# EAGLE design GrblMega2560 (EAGLE 6.6.0)
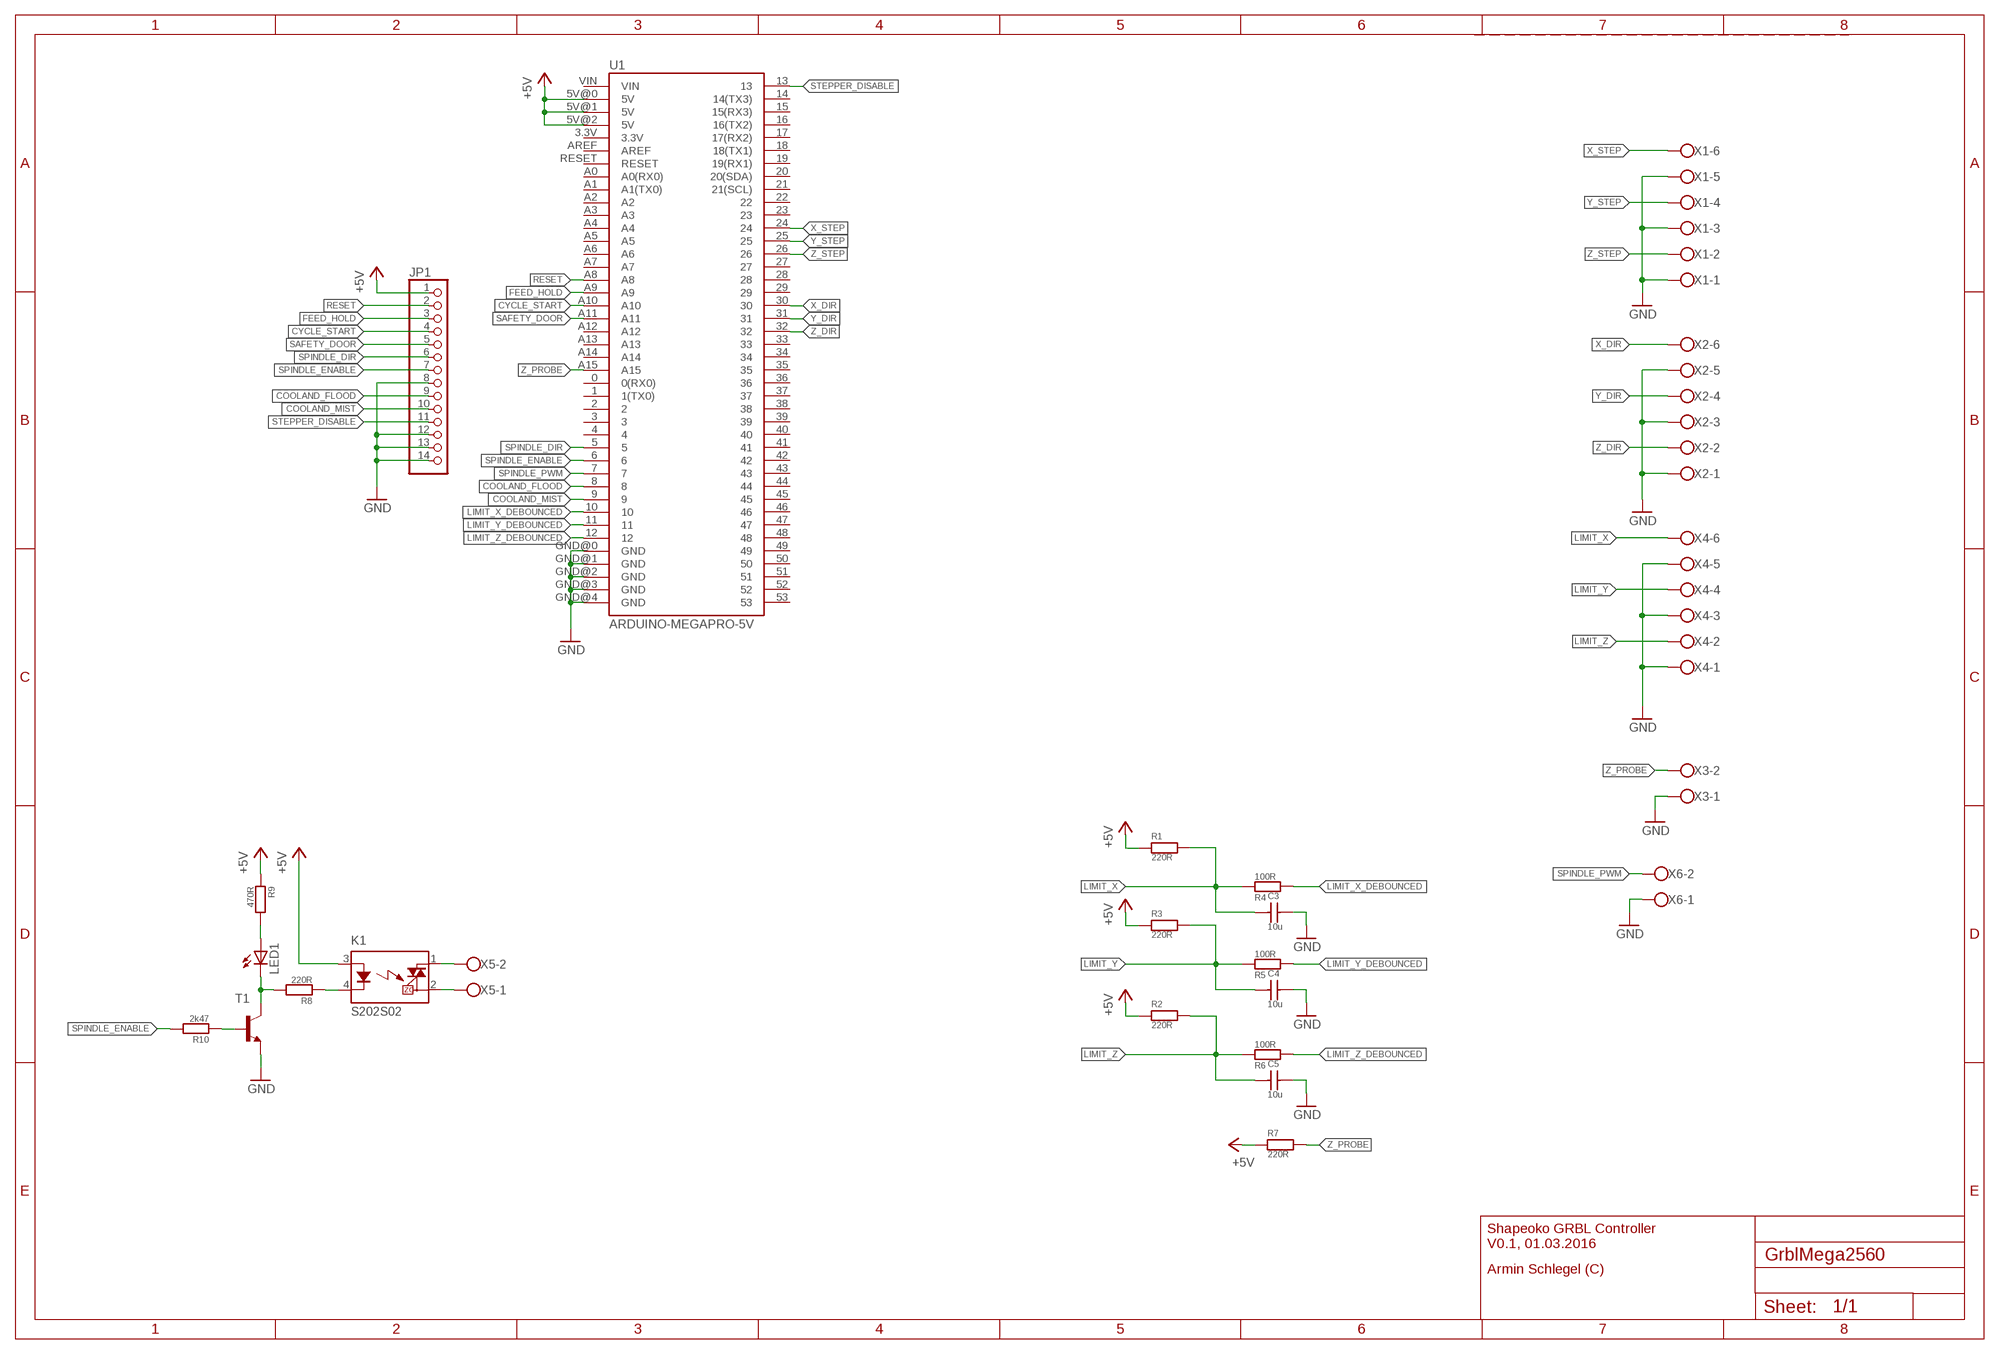
[diagram p0: schematic, sheet 1]

## Parts
C3  10u  C_SMD0805  [C0805]
C4  10u  C_SMD0805  [C0805]
C5  10u  C_SMD0805  [C0805]
JP1  PINHD-1X14  [1X14]
K1  S202S02  [S202S02]
LED1  LED3MM  [LED3MM]
R1  220R  R0603  [R0603]
R2  220R  R0603  [R0603]
R3  220R  R0603  [R0603]
R4  100R  R0603  [R0603]
R5  100R  R0603  [R0603]
R6  100R  R0603  [R0603]
R7  220R  R0603  [R0603]
R8  220R  R0603  [R0603]
R9  470R  R0603  [R0603]
R10  2k47  R0603  [R0603]
T1  BC847-NPN-SOT23-BEC  [SOT23-BEC]
U1  ARDUINO-MEGAPRO-5V  [ARDUINO_MEGA-PRO-5V]
X1  W237-136  [W237-136]
X2  W237-136  [W237-136]
X3  W237-102  [W237-102]
X4  W237-136  [W237-136]
X5  W237-102  [W237-102]
X6  W237-102  [W237-102]

## Nets
+5V: JP1.1 K1.3(A) R1.1 R2.1 R3.1 R7.1 R9.1 U1.5V@0(5V) U1.5V@1(5V) U1.5V@2(5V)
COOLAND_FLOOD: JP1.9 U1.8
COOLAND_MIST: JP1.10 U1.9
CYCLE_START: JP1.4 U1.A10
FEED_HOLD: JP1.3 U1.A9
GND: C3.2 C4.2 C5.2 JP1.8 JP1.12 JP1.13 JP1.14 T1.E U1.GND@0(GND) U1.GND@1(GND) U1.GND@2(GND) U1.GND@3(GND) U1.GND@4(GND) X1.1 X1.3 X1.5 X2.1 X2.3 X2.5 X3.1 X4.1 X4.3 X4.5 X6.1
LIMIT_X: C3.1 R1.2 R4.1 X4.6
LIMIT_X_DEBOUNCED: R4.2 U1.10
LIMIT_Y: C4.1 R3.2 R5.1 X4.4
LIMIT_Y_DEBOUNCED: R5.2 U1.11
LIMIT_Z: C5.1 R2.2 R6.1 X4.2
LIMIT_Z_DEBOUNCED: R6.2 U1.12
N$3: LED1.K(C) R8.2 T1.C
N$4: LED1.A R9.2
N$6: R10.1 T1.B
N$7: K1.4(K) R8.1
RESET: JP1.2 U1.A8
SAFETY_DOOR: JP1.5 U1.A11
SPINDLE_DIR: JP1.6 U1.5
SPINDLE_ENABLE: JP1.7 R10.2 U1.6
SPINDLE_N: K1.2(DS2) X5.1
SPINDLE_P: K1.1(DS1) X5.2
SPINDLE_PWM: U1.7 X6.2
STEPPER_DISABLE: JP1.11 U1.13
X_DIR: U1.30 X2.6
X_STEP: U1.24 X1.6
Y_DIR: U1.31 X2.4
Y_STEP: U1.25 X1.4
Z_DIR: U1.32 X2.2
Z_PROBE: R7.2 U1.A15 X3.2
Z_STEP: U1.26 X1.2
Unconnected: U1.0(0(RX0)) U1.1(1(TX0)) U1.2 U1.3 U1.3.3V U1.4 U1.14(14(TX3)) U1.15(15(RX3)) U1.16(16(TX2)) U1.17(17(RX2)) U1.18(18(TX1)) U1.19(19(RX1)) U1.20(20(SDA)) U1.21(21(SCL)) U1.22 U1.23 U1.27 U1.28 U1.29 U1.33 U1.34 U1.35 U1.36 U1.37 U1.38 U1.39 U1.40 U1.41 U1.42 U1.43 U1.44 U1.45 U1.46 U1.47 U1.48 U1.49 U1.50 U1.51 U1.52 U1.53 U1.A0(A0(RX0)) U1.A1(A1(TX0)) U1.A2 U1.A3 U1.A4 U1.A5 U1.A6 U1.A7 U1.A12 U1.A13 U1.A14 U1.AREF U1.RESET U1.VIN

## Notes on the sheet
- Shapeoko GRBL Controller
  V0.1, 01.03.2016
- Armin Schlegel (C)

## Library data of the parts
C3-C5 = SchlegelAr_Master:C_SMD: C SMD 0402, 0603, 0805, 1206 last modified: Armin Schlegel, 24.03.2014
JP1 = pinhead:PINHD-1X14: PIN HEADER
K1 = relay:S*02S02: IT(rms) 8A, Zero Cross type SIP 4pin Triac output SSR Source: http://sharp-world.com/products/device/lineup/data/pdf/datasheet/s102s02_e.pdf; MPN: S202S02F; OC_FARNELL: 1618475; OC_NEWARK: 14N9588
LED1 = led:LED: LED OSRAM: - CHIPLED LG R971, LG N971, LY N971, LG Q971, LY Q971, LO R971, LY R971 LH N974, LH R974 LS Q976, LO Q976, LY Q976 LO Q996 - Hyper CHIPLED LW Q18S LB Q993, LB Q99A, LB R99A - SideLED LS A670, LO A670, LY A670, LG A670, LP A670 LB A673, LV A673, LT A673, LW A673 LH A674 LY A675 LS A676, LA A676, LO A676, LY A676, LW A676 LS A679, LY A679, LG A679 - Hyper Micro SIDELED® LS Y876, LA Y876, LO Y876, LY Y876 LT Y87S - SmartLED LW L88C, LW L88S LB L89C, LB L89S, LG L890 LS L89K, LO L89K, LY L89K LS L896, LA L896, LO L896, LY L896 - TOPLED LS T670, LO T670, LY T670, LG T670, LP T670 LSG T670, LSP T670, LSY T670, LOP T670, LYG T670 LG T671, LOG T671, LSG T671 LB T673, LV T673, LT T673, LW T673 LH T674 LS T676, LA T676, LO T676, LY T676, LB T676, LH T676, LSB T676, LW T676 LB T67C, LV T67C, LT T67C, LS T67K, LO T67K, LY T67K, LW E67C LS E67B, LA E67B, LO E67B, LY E67B, LB E67C, LV E67C, LT E67C LW T67C LS T679, LY T679, LG T679 LS T770, LO T770, LY T770, LG T770, LP T770 LB T773, LV T773, LT T773, LW T773 LH T774 LS E675, LA E675, LY E675, LS T675 LS T776, LA T776, LO T776, LY T776, LB T776 LHGB T686 LT T68C, LB T68C - Hyper Mini TOPLED® LB M676 - Mini TOPLED Santana® LG M470 LS M47K, LO M47K, LY M47K Source: http://www.osram.convergy.de LUXEON: - LUMILED® LXK2-PW12-R00, LXK2-PW12-S00, LXK2-PW14-U00, LXK2-PW14-V00 LXK2-PM12-R00, LXK2-PM12-S00, LXK2-PM14-U00 LXK2-PE12-Q00, LXK2-PE12-R00, LXK2-PE12-S00, LXK2-PE14-T00, LXK2-PE14-U00 LXK2-PB12-K00, LXK2-PB12-L00, LXK2-PB12-M00, LXK2-PB14-N00, LXK2-PB14-P00, LXK2-PB14-Q00 LXK2-PR12-L00, LXK2-PR12-M00, LXK2-PR14-Q00, LXK2-PR14-R00 LXK2-PD12-Q00, LXK2-PD12-R00, LXK2-PD12-S00 LXK2-PH12-R00, LXK2-PH12-S00 LXK2-PL12-P00, LXK2-PL12-Q00, LXK2-PL12-R00 Source: www.luxeon.com KINGBRIGHT: KA-3528ASYC Source: www.kingbright.com
R1-R10 = SchlegelAr_Master:R: Widerstaende in 0402, 0603, 0805, 1206, 2512 last modified: Armin Schlegel, 28.04.2014
T1 = transistor:*-NPN-: NPN Transistror BF959 corrected 2008.03.06
U1 = SparkFun-Boards:ARDUINO-MEGA: Arduino Mega board footprint
X1 X2 X4 = con-wago-500:W237-136: WAGO SCREW CLAMP; MPN: 237-136; OC_FARNELL: unknown; OC_NEWARK: 84K9151
X3 X5 X6 = con-wago-500:W237-102: WAGO SCREW CLAMP; MPN: 237-102; OC_FARNELL: unknown; OC_NEWARK: 70K9898

## Board
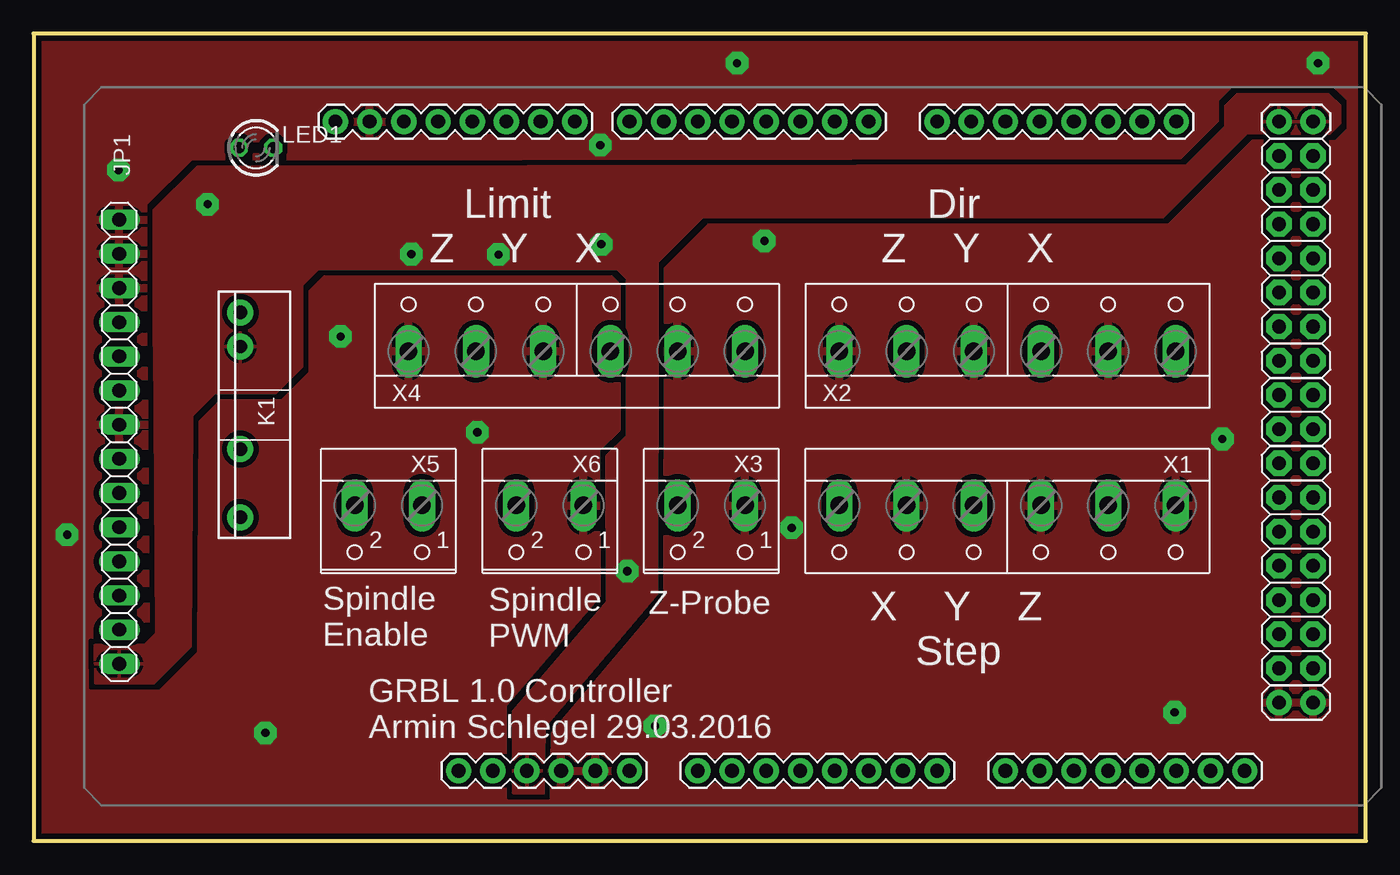
[diagram p1: board, top side]
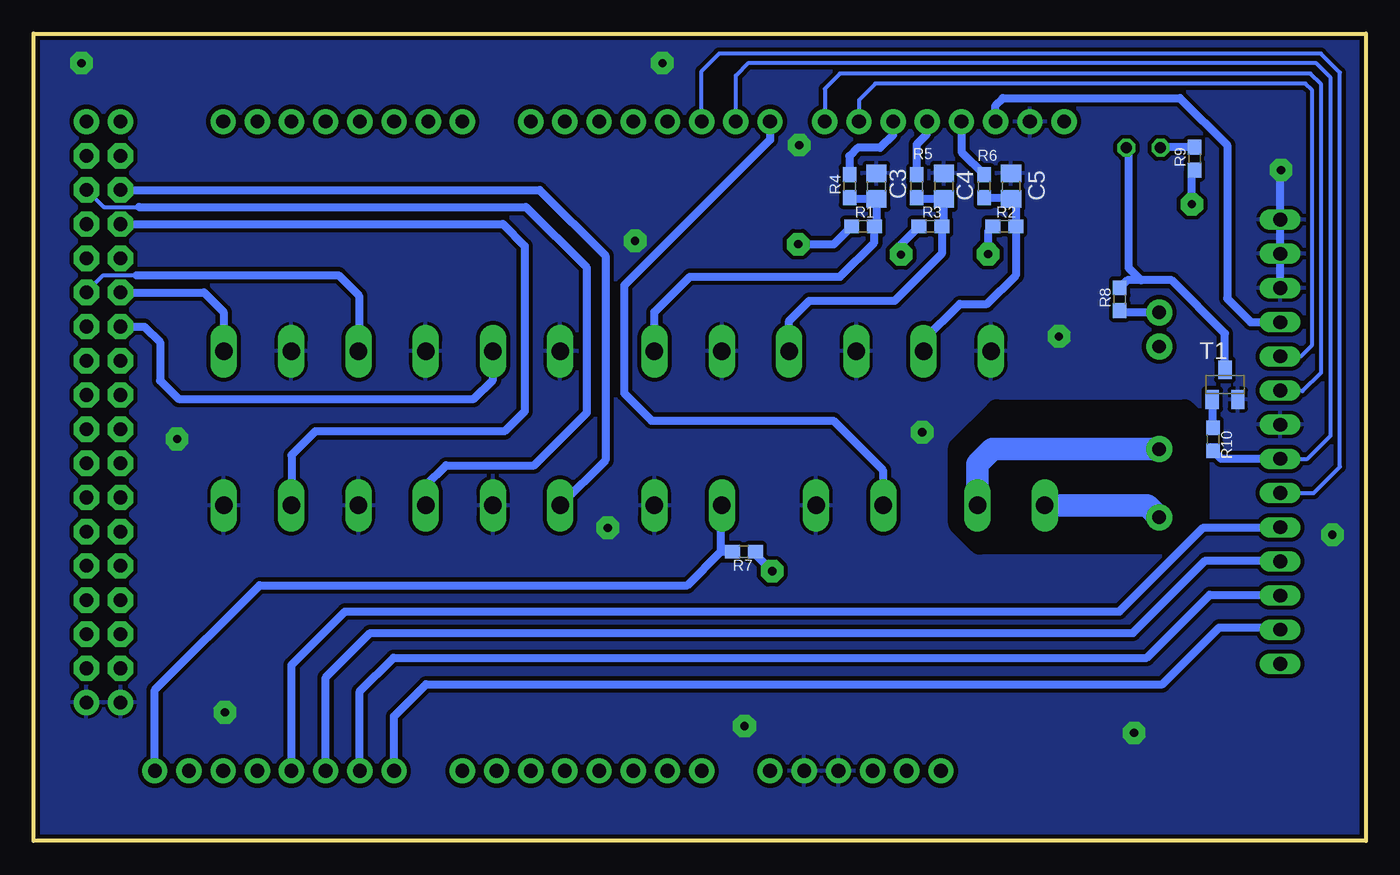
[diagram p2: board, bottom side, seen from below]

Size 99 x 60 mm. Coordinates in mm from the lower left corner, seen from the top.
Outline: 0,0 99,0 99,60 0,60 0,0
Copper layers (1*16): Top 0.035mm / dielectric 1.5mm / Bottom 0.035mm
Design rules "Elecrow_2-layer_eagle_rule": minimum track width 6mil, minimum drill 12mil, track to track 6mil, track to pad 6mil, pad to pad 6mil, via to via 6mil, smd to smd 0mil, copper to edge 10mil, drill to drill 10mil, minimum pad ring 10mil, minimum via ring 6mil, stop-mask expansion 2mil, vias tented up to drill 100mil, thermal gap 10mil
bRestrict: area 12.4,22.1 to 30.2,32

### Footprints (pad centres in the part's own frame; a part is rotated, then mirrored left to right if it is on the bottom)
C0805 = smd 1.3 x 1.5: 1 -0.95,0; 2 0.95,0
1X14 = drill 1.016 long: 1 -16.51,0; 2 -13.97,0; 3 -11.43,0; 4 -8.89,0; 5 -6.35,0; 6 -3.81,0; 7 -1.27,0; 8 1.27,0; 9 3.81,0; 10 6.35,0; 11 8.89,0; 12 11.43,0; 13 13.97,0; 14 16.51,0
S202S02 = drill 1 pad 1.93: 1 -7.62,0; 2 -2.54,0; 3 5.08,0; 4 7.62,0
LED3MM = drill 0.813 octagon: A -1.27,0; K 1.27,0
R0603 = smd 1.1 x 1: 1 -0.85,0; 2 0.85,0
SOT23-BEC = smd 1 x 1.4: B -0.95,-1.1; C 0,1.1; E 0.95,-1.1
ARDUINO_MEGA-PRO-5V = drill 1.016 pad 1.88: 0 60.85,50.8; 1 58.31,50.8; 2 55.77,50.8; 3 53.23,50.8; 3.3V 32.91,2.54; 4 50.69,50.8; 5 48.15,50.8; 5V@0 35.45,2.54; 5V@1 91.33,50.8; 5V@2 93.87,50.8; 6 45.61,50.8; 7 43.07,50.8; 8 39.006,50.8; 9 36.466,50.8; 10 33.926,50.8; 11 31.386,50.8; 12 28.846,50.8; 13 26.306,50.8; 14 65.93,50.8; 15 68.47,50.8; 16 71.01,50.8; 17 73.55,50.8; 18 76.09,50.8; 19 78.63,50.8; 20 81.17,50.8; 21 83.71,50.8; A0 48.15,2.54; A1 50.69,2.54; A2 53.23,2.54; A3 55.77,2.54; A4 58.31,2.54; A5 60.85,2.54; A6 63.39,2.54; A7 65.93,2.54; A8 71.01,2.54; A9 73.55,2.54; A10 76.09,2.54; A11 78.63,2.54; A12 81.17,2.54; A13 83.71,2.54; A14 86.25,2.54; A15 88.79,2.54; AREF 21.226,50.8; GND@0 37.99,2.54; GND@1 40.53,2.54; GND@2 91.33,7.62; GND@3 93.87,7.62; GND@4 23.766,50.8; RESET 30.37,2.54; VIN 43.07,2.54 | drill 1.016 pad 1.88 octagon: 22 91.33,48.26; 23 93.87,48.26; 24 91.33,45.72; 25 93.87,45.72; 26 91.33,43.18; 27 93.87,43.18; 28 91.33,40.64; 29 93.87,40.64; 30 91.33,38.1; 31 93.87,38.1; 32 91.33,35.56; 33 93.87,35.56; 34 91.33,33.02; 35 93.87,33.02; 36 91.33,30.48; 37 93.87,30.48; 38 91.33,27.94; 39 93.87,27.94; 40 91.33,25.4; 41 93.87,25.4; 42 91.33,22.86; 43 93.87,22.86; 44 91.33,20.32; 45 93.87,20.32; 46 91.33,17.78; 47 93.87,17.78; 48 91.33,15.24; 49 93.87,15.24; 50 91.33,12.7; 51 93.87,12.7; 52 91.33,10.16; 53 93.87,10.16
W237-136 = drill 1.3 long: 1 -12.5,-1.27; 2 -7.5,-1.27; 3 -2.5,-1.27; 4 2.5,-1.27; 5 7.5,-1.27; 6 12.5,-1.27
W237-102 = drill 1.3 long: 1 -2.5,-1.27; 2 2.5,-1.27

### Placement (x,y rotation side)
C3  36.36,48.66 90 bottom
C4  31.36,48.66 90 bottom
C5  26.36,48.66 90 bottom
JP1  6.36,29.66 90 top
K1  15.36,31.66 90 top
LED1  16.53,51.51 0 top
R1  37.36,45.66 0 bottom
R2  26.86,45.66 0 bottom
R3  32.36,45.66 0 bottom
R4  38.36,48.66 90 bottom
R5  33.36,48.66 90 bottom
R6  28.36,48.66 90 bottom
R7  46.22,21.49 180 bottom
R8  18.29,40.26 90 bottom
R9  12.73,50.71 90 bottom
R10  11.36,29.85 270 bottom
T1  10.46,33.91 0 bottom
U1  1.21,2.66 0 top
X1  72.36,23.66 180 top
X2  72.36,37.66 0 top
X3  50.36,23.66 180 top
X4  40.36,37.66 0 top
X5  26.36,23.66 180 top
X6  38.36,23.66 180 top

### Tracks (layer width: path | path; a pad name or v marks a point on that pad's centre or on a via)
+5V  (via drill 0.61 pad 1.68)
  Bottom 0.61: v12.93,47.32 12.93,49.67 R9.1 | v28.07,43.61 28.07,45.31 R2.1 | v34.54,43.59 34.54,44.33 R3.1 | v42.19,44.35 39.53,44.35 R1.1 | R7.1 45.37,21.29 v44.12,20.04
  pour Top (isolate 0.406): 96.27,52.58 90.17,52.65 83.9,46.38 49.71,46.38 46.33,43 46.33,39.17 46.3,18.34 37.95,8.46 37.85,3.53 35.66,3.58 35.66,9.63 42.65,17.75 42.62,28.6 44.12,30.1 44.12,41.78 43.38,42.52 21.13,42.52 19.91,41.3 19.91,35.26 17.98,33.32 13.46,33.32 11.76,31.62 11.63,14.45 8.92,11.73 4.6,11.73 4.57,14.53 8.26,14.53 9.14,15.42 8.99,36.83 8.97,36.83 8.97,46.86 12.19,50.09 85.7,50.19 88.6,53.09 88.6,54.61 89.46,55.47 96.22,55.47 97.05,54.64 97.05,53.34 96.85,53.14
COOLAND_FLOOD
  Bottom 0.305: JP1.9 6.31,33.42 4.71,33.42 3.33,34.8 3.33,56.24 4.12,57.02 39.09,57.02 40.21,55.91 U1.8
COOLAND_MIST
  Bottom 0.305: JP1.10 4.83,36.01 3.99,36.85 3.99,55.78 4.5,56.29 36.45,56.29 37.67,55.07 U1.9
CYCLE_START
  Bottom 0.61: U1.A10 77.3,12.14 73.99,15.44 17.3,15.44 11.91,20.83 6.42,20.83 JP1.4
FEED_HOLD
  Bottom 0.61: U1.A9 74.76,11.12 72.26,13.61 16.28,13.61 11.61,18.29 6.42,18.29 JP1.3
GND  (via drill 0.61 pad 1.68)
  Bottom 0.61: JP1.12 6.36,49.8 v6.3,49.86
  other vias: 2.49,22.76 32.97,30.38 56.34,23.27 88.34,29.87 54.31,44.6 52.27,57.81 42.11,51.71 84.79,9.55 46.18,8.53 17.22,8.03 22.81,37.49 95.45,57.81
  pour Bottom (isolate 0.305, rank 3): 0.03,59.97 99.01,59.97 99.01,0 0.03,0
  pour Top (isolate 0.406, rank 6): 0.03,59.97 98.98,59.97 98.98,-0.03 0.03,-0.03
LIMIT_X
  Bottom 0.61: R4.1 38.26,47.71 C3.1 36.36,45.81 R1.2 36.52,45.65 36.52,44.48 39.06,41.94 50.24,41.94 52.86,39.31 X4.6
LIMIT_X_DEBOUNCED
  Bottom 0.61: U1.10 35.13,52.47 36.09,51.51 37.77,51.51 38.38,50.9 38.38,49.53 R4.2
LIMIT_Y
  Bottom 0.305: 31.36,45.81 R3.2
  Bottom 0.61: 31.36,45.81 C4.1 33.26,47.71 R5.1 | X4.4 42.86,38.65 41.35,40.16 35,40.16 31.51,43.65 R3.2
LIMIT_Y_DEBOUNCED
  Bottom 0.61: R5.2 33.36,51.78 32.64,52.5 32.64,53.42 U1.11
LIMIT_Z
  Bottom 0.305: 26.01,47.36 C5.1
  Bottom 0.61: R6.1 26.46,47.81 C5.1 | 26.01,47.36 R2.2 26.01,42.03 28.14,39.9 30.18,39.9 32.86,37.22 X4.2
LIMIT_Z_DEBOUNCED
  Bottom 0.61: U1.12 30.05,51.2 R6.2
N$3
  Bottom 0.61: T1.C 10.46,37.72 14.43,41.68 16.71,41.68 | 16.71,41.68 17.72,41.68 R8.2 | 16.71,41.68 17.62,42.59 17.62,51.34 LED1.K
N$4
  Bottom 0.61: R9.2 15.21,51.56 LED1.A
N$6
  Bottom 0.61: T1.B 11.41,30.76 R10.1
N$7
  Bottom 0.61: K1.4 18.17,39.28 R8.1
RESET
  Bottom 0.61: U1.A8 72.22,9.27 69.85,11.63 15.11,11.63 10.9,15.85 6.52,15.85 JP1.2
SAFETY_DOOR
  Bottom 0.61: U1.A11 79.84,13.08 75.87,17.04 18.31,17.04 12.06,23.29 6.38,23.29 JP1.5
SPINDLE_DIR
  Bottom 0.305: JP1.6 3.88,25.85 1.93,27.81 1.93,57.1 3.35,58.52 48.06,58.52 49.36,57.22 U1.5
SPINDLE_ENABLE
  Bottom 0.305: JP1.7 4.34,28.39 2.62,30.12 2.62,56.72 3.68,57.78 45.92,57.78 46.82,56.89 U1.6
  Bottom 0.61: JP1.7 10.75,28.39 R10.2
SPINDLE_N
  Bottom 1.676: K1.2 27.75,29.12 28.86,28.01 X5.1
SPINDLE_P
  Bottom 1.676: X5.2 16.25,24.93 K1.1
SPINDLE_PWM
  Bottom 0.61: U1.7 44.28,52.12 55.12,41.27 55.12,33.27 53.09,31.24 39.57,31.24 38.91,30.58 35.89,27.56 35.89,24.96 X6.2
STEPPER_DISABLE
  Bottom 0.61: U1.13 27.51,54.68 26.98,55.22 13.82,55.22 10.31,51.71 10.31,40.31 8.56,38.56 JP1.11
X_DIR
  Bottom 0.61: U1.30 86.33,40.76 84.89,39.32 84.89,36.42 X2.6
X_STEP
  Bottom 0.61: U1.24 61.39,48.38 56.52,43.51 56.52,28.28 X1.6
Y_DIR
  Bottom 0.305: U1.31 95.08,40.77 93.81,42.04 91.11,42.04 91.36,42.04
  Bottom 0.61: 91.36,42.04 76.35,42.04 74.83,40.51 74.83,36.43 X2.4
Y_STEP
  Bottom 0.305: U1.25 95.04,48.38 93.78,47.12 91.19,47.12
  Bottom 0.61: X1.4 69.86,26.4 68.35,27.91 61.8,27.91 57.89,31.83 57.89,42.6 62.41,47.12 91.19,47.12
Z_DIR
  Bottom 0.61: U1.32 90.78,38.22 89.61,37.06 89.61,34.21 88.24,32.84 66.29,32.84 64.87,34.27 64.87,36.38 X2.2
Z_PROBE
  Bottom 0.61: U1.A15 90,11.22 82.22,19 50.42,19 47.9,21.51 | 47.9,21.51 47.9,24.89 X3.2 | R7.2 47.88,21.49 47.9,21.51
Z_STEP
  Bottom 0.61: U1.26 64.13,45.84 62.51,44.22 62.51,31.93 64.01,30.43 78.08,30.43 79.83,28.68 79.83,24.96 X1.2

### Text on the board
tNames: Limit / Z Y X | Dir / Z Y X | Z-Probe | Spindle / Enable | Spindle / PWM | X Y Z / Step | GRBL 1.0 Controller / Armin Schlegel 29.03.2016